# EAGLE schematic tvbgone-adj (EAGLE 5.11)
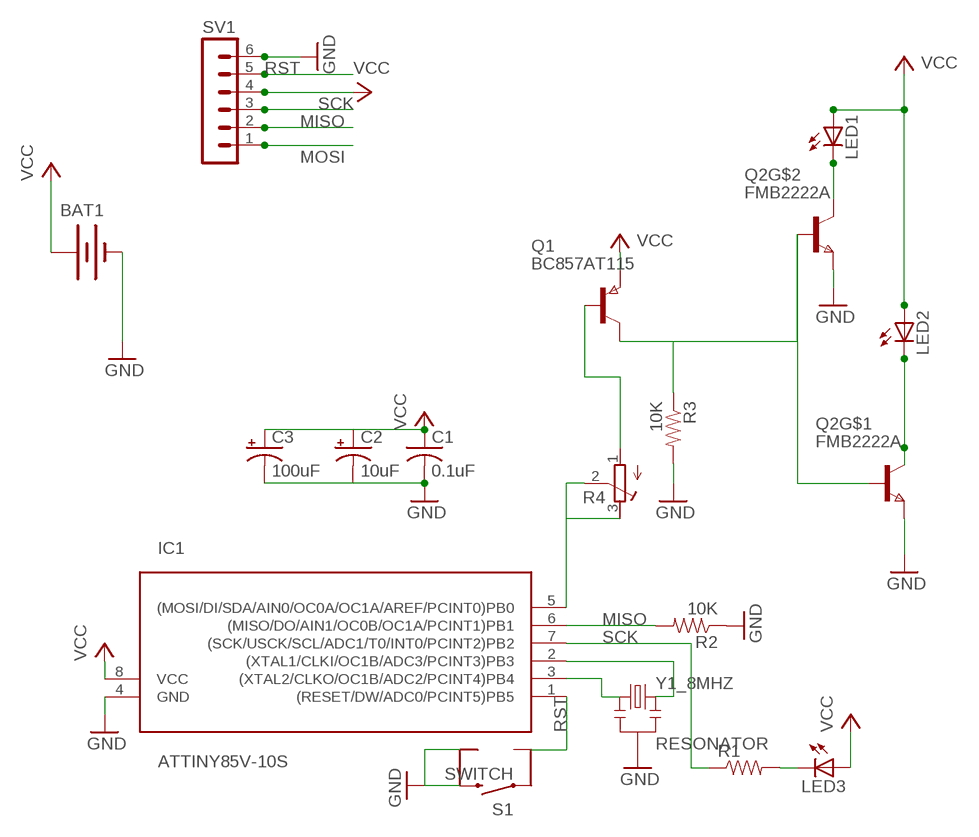
[diagram p0: schematic, sheet 1]

## Parts
BAT1  BATTERYCR123A  [BATTERY_CR123A]
C1  0.1uF  C-USC0805K  [C0805K]
C2  10uF  CAP_POL1206  [EIA3216]
C3  100uF  CAP_POL7343  [EIA7343]
IC1  ATTINY85V-10S  [SOIC8]
LED1  LEDSIDEIR  [SIDE_IR_NSL]
LED2  LEDSIDEIR  [SIDE_IR_NSL]
LED3  LEDCHIPLED_1206  [CHIPLED_1206]
Q1  BC857AT115  PNPSOT323SOT416  [SOT416]
Q2  FMB2222A  DUALNPN  [SSOT6]
R1  1.5K  RESISTOR1206  [1206]
R2  10K  RESISTOR  [0805]
R3  10K  RESISTOR  [0805]
R4  R-TRIMM3103  [RTRIM3103]
S1  SWITCH  SWITCH-MOMENTARY-2SMD  [TACTILE_SWITCH_SMD]
SV1  CON-LSTB_MA06-1  [CON-LSTB_MA06-1]
Y1_8MHZ  RESONATOR  RESONATORSMD  [RESONATOR-SMD]

## Nets
GND: BAT1.- C1.2 C2.C(-) C3.C(-) IC1.4(GND) Q2.2(E) Q2.5(E) R2.1 R3.2 S1.3 S1.4 SV1.6 Y1_8MHZ.2
MISO: IC1.6((MISO/DO/AIN1/OC0B/OC1A/PCINT1)PB1) R2.2 SV1.2
MOSI: IC1.5((MOSI/DI/SDA/AIN0/OC0A/OC1A/AREF/PCINT0)PB0) R4.2(S) R4.3(A) SV1.1
N$1: IC1.3((XTAL2/CLKO/OC1B/ADC2/PCINT4)PB4) Y1_8MHZ.1
N$2: IC1.2((XTAL1/CLKI/OC1B/ADC3/PCINT3)PB3) Y1_8MHZ.3
N$3: LED3.C R1.2
N$4: LED1.C Q2.4(C)
N$5: LED2.C Q2.6(C)
N$6: Q1.2(B) R4.1(E)
N$7: Q1.1(C) Q2.1(B) Q2.3(B) R3.1
RST: IC1.1((RESET/DW/ADC0/PCINT5)PB5) S1.2 SV1.5
SCK: IC1.7((SCK/USCK/SCL/ADC1/T0/INT0/PCINT2)PB2) R1.1 SV1.3
VCC: BAT1.+ C1.1 C2.A(+) C3.A(+) IC1.8(VCC) LED1.A LED2.A LED3.A Q1.3(E) SV1.4
Unconnected: S1.1

## Library data of the parts
BAT1 = tvbgone-adj:BATTERY: Battery Holders Various common sizes : AA, AAA, 20mm coin cell and 12mm coin cell.
C1 = rcl-ez:C-US: CAPACITOR, American symbol
C2 C3 = SparkFun:CAP_POL: Capacitor Polarized These are standard SMD and PTH capacitors. Normally 10uF, 47uF, and 100uF in electrolytic and tantalum varieties. Always verify the external diameter of the through hole cap, it varies with capacity, voltage, and manufacturer. The EIA devices should be standard.
IC1 = avr:ATTINY85: MICROCONTROLLER 8 Kbytes FLASH 512 bytes EEPROM 512 bytes RAM 4-channel 10 bit ADC USI
LED1 LED2 = tvbgone3:LED: LED
LED3 = minimidi:LED: LED
Q1 = zetex:PNPSOT323: PNP TRANSISTOR
Q2 = fairchild-semic:DUALNPN
R1-R3 = SparkFun:RESISTOR: Resistor Basic schematic elements and footprints for 0603, 1206, and PTH 1/10th watt (small) resistors.
R4 = resistor:R-TRIMM: Trimm resistor
S1 = SparkFun:SWITCH-MOMENTARY-2
SV1 = NSL:CON-LSTB_MA06-1: PIN HEADER
Y1_8MHZ = SparkFun:RESONATOR: Resonator Small SMD resonator. This is the itty bitty 10/20MHz resonators with built in caps. CSTCE10M0G55 and CSTCE20M0V53. Footprint has been reviewed closely but hasn't been tested yet.